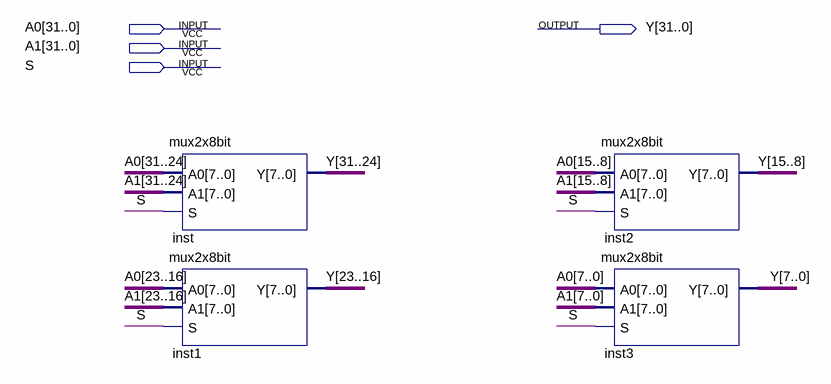
[diagram p0: schematic sheet]
// Quartus schematic mux2x32bit.bdf as structural Verilog: 4 symbols, 4 pins
module mux2x32bit (
  input  [31:0] A0,
  input  [31:0] A1,
  input  S,
  output [31:0] Y
);

  mux2x8bit inst (.A0(A0[31:24]), .A1(A1[31:24]), .S(S), .Y(Y[31:24]));
  mux2x8bit inst1 (.A0(A0[23:16]), .A1(A1[23:16]), .S(S), .Y(Y[23:16]));
  mux2x8bit inst2 (.A0(A0[15:8]), .A1(A1[15:8]), .S(S), .Y(Y[15:8]));
  mux2x8bit inst3 (.A0(A0[7:0]), .A1(A1[7:0]), .S(S), .Y(Y[7:0]));
endmodule
